# EAGLE design adsr (EAGLE 6.5.0)
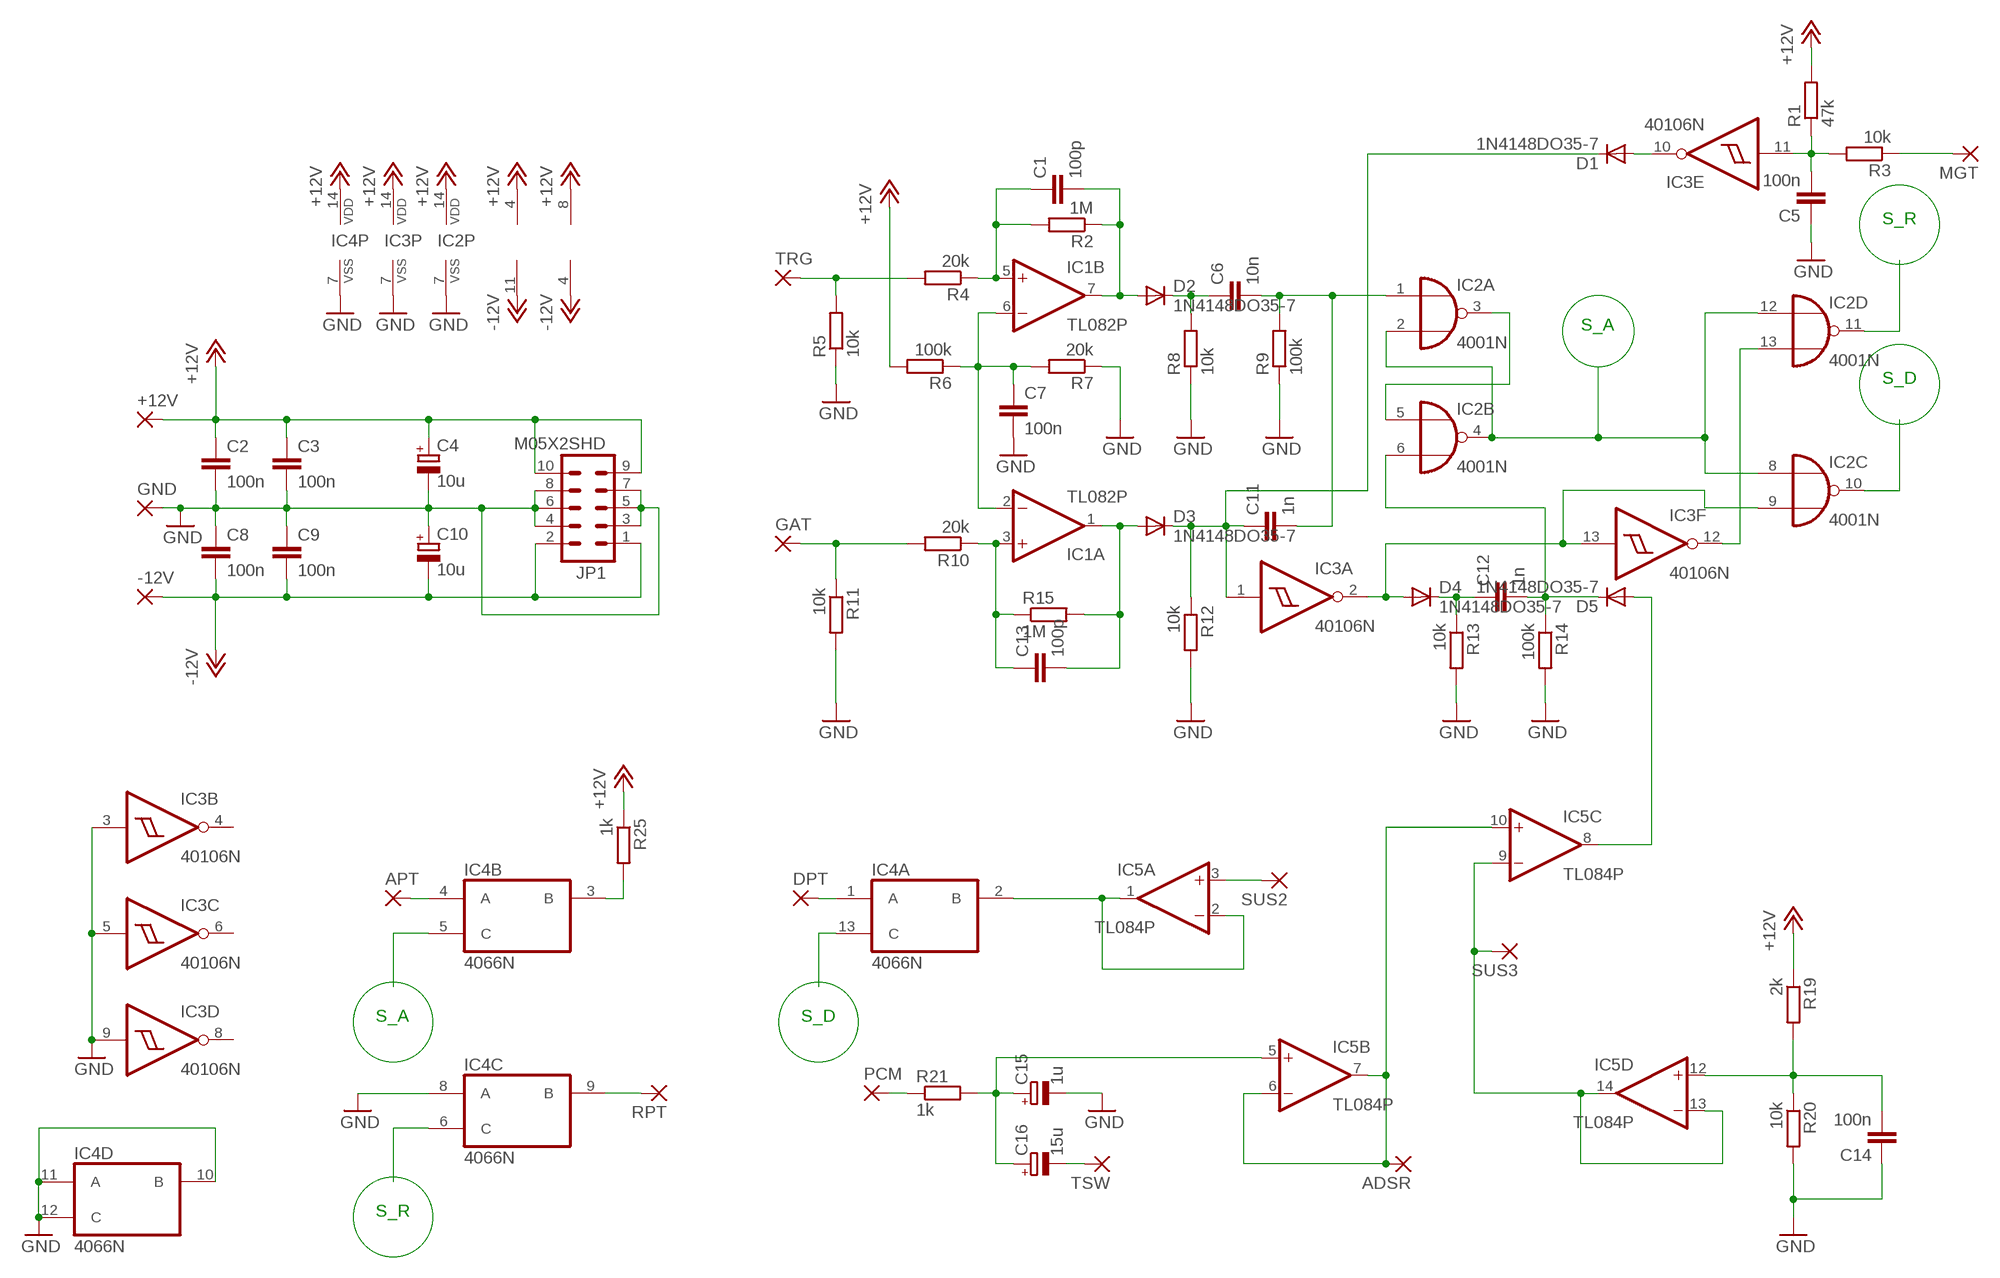
[diagram p0: schematic, sheet 1]

## Parts
+12V  2,54/1,0  [2,54/1,0]
-12V  2,54/1,0  [2,54/1,0]
ADSR  2,54/1,0  [2,54/1,0]
APT  2,54/1,0  [2,54/1,0]
C1  100p  C-EU050-035X075  [C050-035X075]
C2  100n  C-EU050-035X075  [C050-035X075]
C3  100n  C-EU050-035X075  [C050-035X075]
C4  10u  CPOL-EUE3.5-8  [E3,5-8]
C5  100n  C-EU050-035X075  [C050-035X075]
C6  10n  C-EU050-035X075  [C050-035X075]
C7  100n  C-EU050-035X075  [C050-035X075]
C8  100n  C-EU050-035X075  [C050-035X075]
C9  100n  C-EU050-035X075  [C050-035X075]
C10  10u  CPOL-EUE3.5-8  [E3,5-8]
C11  1n  C-EU050-035X075  [C050-035X075]
C12  1n  C-EU050-035X075  [C050-035X075]
C13  100p  C-EU050-035X075  [C050-035X075]
C14  100n  C-EU050-035X075  [C050-035X075]
C15  1u  CPOL-EUE2.5-6  [E2,5-6]
C16  15u  CPOL-EUE3.5-8  [E3,5-8]
D1  1N4148DO35-7  [DO35-7]
D2  1N4148DO35-7  [DO35-7]
D3  1N4148DO35-7  [DO35-7]
D4  1N4148DO35-7  [DO35-7]
D5  1N4148DO35-7  [DO35-7]
DPT  2,54/1,0  [2,54/1,0]
GAT  2,54/1,0  [2,54/1,0]
GND  2,54/1,0  [2,54/1,0]
IC1  TL082P  [DIL08]
IC2  4001N  [DIL14]
IC3  40106N  [DIL14]
IC4  4066N  [DIL14]
IC5  TL084P  [DIL14]
JP1  M05X2SHD  [2X5-SHROUDED]
MGT  2,54/1,0  [2,54/1,0]
PCM  2,54/1,0  [2,54/1,0]
R1  47k  R-EU_0309/10  [0309/10]
R2  1M  R-EU_0309/10  [0309/10]
R3  10k  R-EU_0309/10  [0309/10]
R4  20k  R-EU_0309/10  [0309/10]
R5  10k  R-EU_0309/10  [0309/10]
R6  100k  R-EU_0309/10  [0309/10]
R7  20k  R-EU_0309/10  [0309/10]
R8  10k  R-EU_0309/10  [0309/10]
R9  100k  R-EU_0309/10  [0309/10]
R10  20k  R-EU_0309/10  [0309/10]
R11  10k  R-EU_0309/10  [0309/10]
R12  10k  R-EU_0309/10  [0309/10]
R13  10k  R-EU_0309/10  [0309/10]
R14  100k  R-EU_0309/10  [0309/10]
R15  1M  R-EU_0309/10  [0309/10]
R19  2k  R-EU_0309/10  [0309/10]
R20  10k  R-EU_0309/10  [0309/10]
R21  1k  R-EU_0309/10  [0309/10]
R25  1k  R-EU_0309/10  [0309/10]
RPT  2,54/1,0  [2,54/1,0]
SUS2  2,54/1,0  [2,54/1,0]
SUS3  2,54/1,0  [2,54/1,0]
TRG  2,54/1,0  [2,54/1,0]
TSW  2,54/1,0  [2,54/1,0]

## Nets
+12V: +12V.1(P) C2.1 C3.1 C4.+ IC1.8(P:V+) IC2.14(P:VDD) IC3.14(P:VDD) IC4.14(P:VDD) IC5.4(P:V+) JP1.9 JP1.10 R1.2 R6.2 R19.1 R25.1
-12V: -12V.1(P) C8.2 C9.2 C10.- IC1.4(P:V-) IC5.11(P:V-) JP1.1 JP1.2
GND: C2.2 C3.2 C4.- C5.1 C7.2 C8.1 C9.1 C10.+ C14.1 C15.- GND.1(P) IC2.7(P:VSS) IC3.3(B:I) IC3.5(C:I) IC3.7(P:VSS) IC3.9(D:I) IC4.7(P:VSS) IC4.8(C:A) IC4.10(D:B) IC4.11(D:A) IC4.12(D:C) JP1.3 JP1.4 JP1.5 JP1.6 JP1.7 JP1.8 R5.1 R7.1 R8.1 R9.1 R11.2 R12.2 R13.2 R14.2 R20.2
N$1: C1.1 IC1.5(B:+IN) R2.2 R4.1
N$2: R4.2 R5.2 TRG.1(P)
N$3: C1.2 D2.A IC1.7(B:OUT) R2.1
N$4: C7.1 IC1.2(A:-IN) IC1.6(B:-IN) R6.1 R7.2
N$5: C6.1 D2.C R8.2
N$6: C6.2 C11.2 IC2.1(A:I0) R9.2
N$7: C13.2 D3.A IC1.1(A:OUT) R15.2
N$8: C13.1 IC1.3(A:+IN) R10.1 R15.1
N$9: GAT.1(P) R10.2 R11.1
N$10: D4.A IC2.9(C:I1) IC3.2(A:O) IC3.13(F:I)
N$11: IC2.3(A:O) IC2.5(B:I0)
N$12: C11.1 D1.C D3.C IC3.1(A:I) R12.1
N$13: C12.1 D4.C R13.1
N$14: C12.2 D5.C IC2.6(B:I1) R14.1
N$15: D5.A IC5.8(C:OUT)
N$16: IC2.13(D:I1) IC3.12(F:O)
N$17: C5.2 IC3.11(E:I) R1.1 R3.2
N$18: D1.A IC3.10(E:O)
N$19: MGT.1(P) R3.1
N$20: IC5.9(C:-IN) IC5.13(D:-IN) IC5.14(D:OUT) SUS3.1(P)
N$21: ADSR.1(P) IC5.6(B:-IN) IC5.7(B:OUT) IC5.10(C:+IN)
N$22: IC5.3(A:+IN) SUS2.1(P)
N$23: IC4.2(A:B) IC5.1(A:OUT) IC5.2(A:-IN)
N$24: DPT.1(P) IC4.1(A:A)
N$25: APT.1(P) IC4.4(B:A)
N$26: IC4.3(B:B) R25.2
N$27: IC4.9(C:B) RPT.1(P)
N$28: PCM.1(P) R21.1
N$29: C16.- TSW.1(P)
N$30: C15.+ C16.+ IC5.5(B:+IN) R21.2
N$31: C14.2 IC5.12(D:+IN) R19.2 R20.1
S_A: IC2.2(A:I1) IC2.4(B:O) IC2.8(C:I0) IC2.12(D:I0) IC4.5(B:C)
S_D: IC2.10(C:O) IC4.13(A:C)
S_R: IC2.11(D:O) IC4.6(C:C)
Unconnected: IC3.4(B:O) IC3.6(C:O) IC3.8(D:O)

## Notes on the sheet
- S_R
- S_A
- S_D
- S_A | S_D
- S_R

## Library data of the parts
+12V -12V ADSR APT DPT GAT GND MGT PCM RPT SUS2 SUS3 TRG TSW = wirepad:2,54/1,0: THROUGH-HOLE PAD
C1-C3 C5-C9 C11-C14 = rcl:C-EU: CAPACITOR, European symbol
C4 C10 C15 C16 = rcl:CPOL-EU: POLARIZED CAPACITOR, European symbol
D1-D5 = diode:1N4148: DIODE high speed (Philips)
IC1 = cavalier:TL082: OP AMP
IC2 = 40xx:4001: Quad 2-input NOR
IC3 = 40xx:40106: Hex SCHMITT TRIGGER
IC4 = 40xx:4066: Quad bilateral ANALOG SWITCH
IC5 = cavalier:TL084: OP AMP
JP1 = SparkFun:M05X2: Header 5x2 Standard 10-pin dual row 0.1" header. Commonly used with AVR-ISP. Use with Spark Fun Electronics SKU: PRT-00778
R1-R15 R19-R21 R25 = rcl:R-EU_: RESISTOR, European symbol

## Board
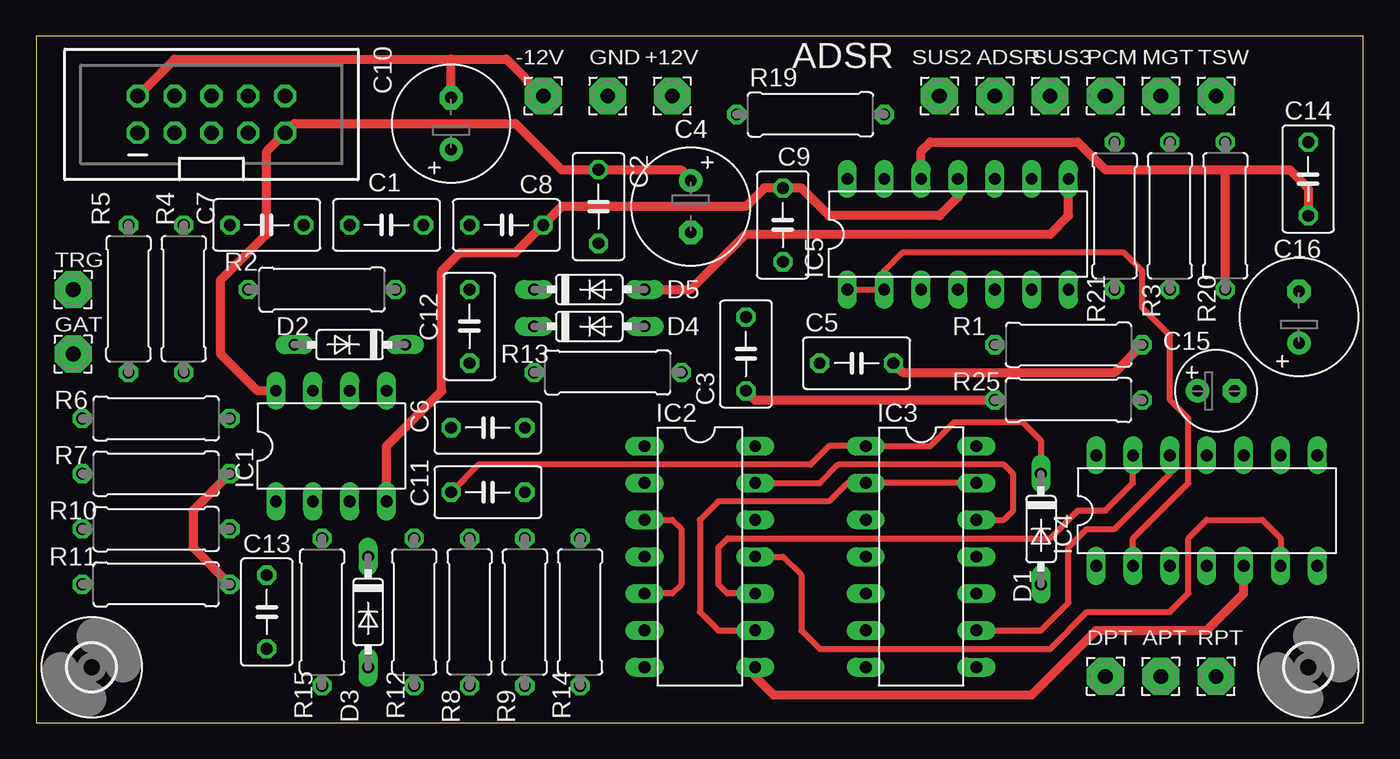
[diagram p1: board, top side]
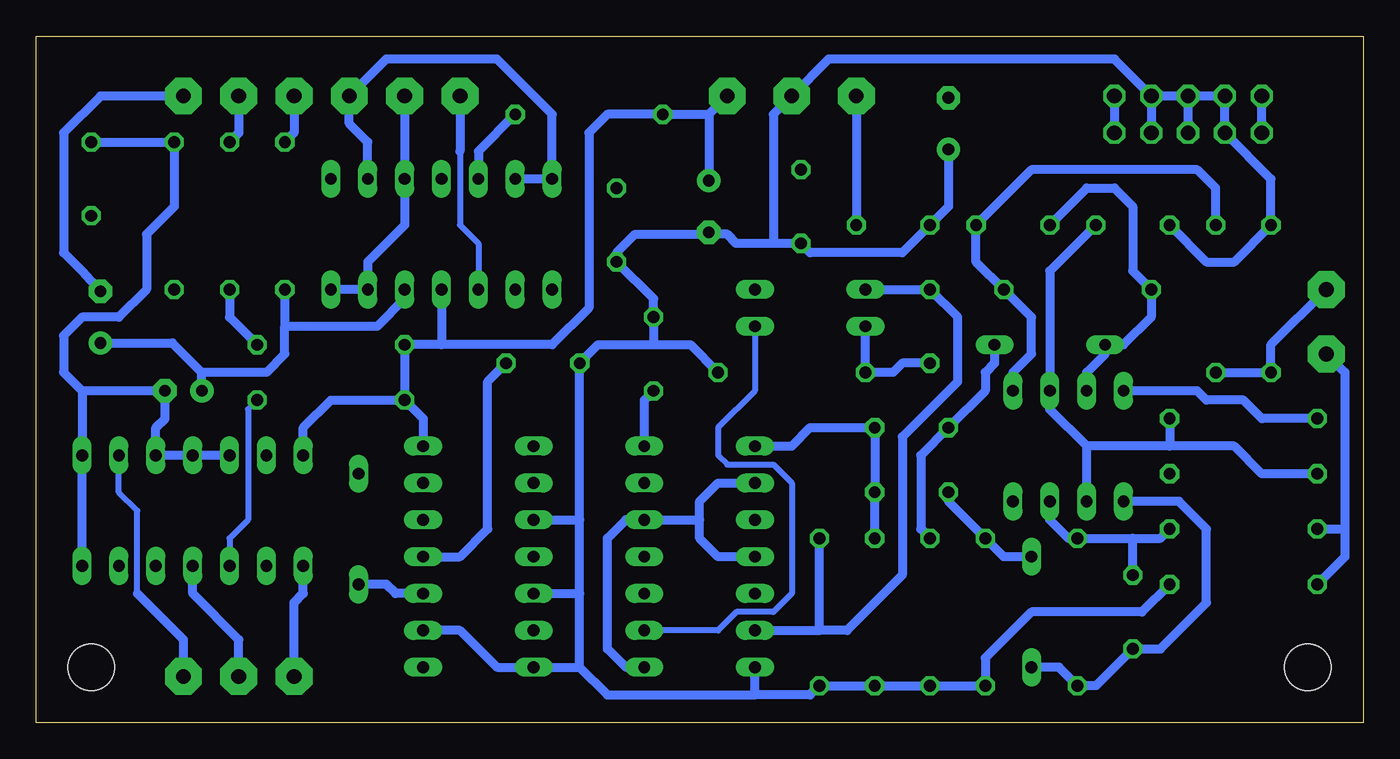
[diagram p2: board, bottom side, seen from below]

Size 91.42 x 47.3 mm. Coordinates in mm from the lower left corner, seen from the top.
Outline: 0,0 91.42,0 91.42,47.3 0,47.3 0,0
Copper layers (1*16): Top 0.035mm / dielectric 1.5mm / Bottom 0.035mm
Design rules "default": minimum track width 10mil, minimum drill 24mil, track to track 8mil, track to pad 8mil, pad to pad 8mil, via to via 8mil, smd to smd 8mil, copper to edge 40mil, drill to drill 8mil, minimum pad ring 10mil, minimum via ring 8mil, stop-mask expansion 4mil, vias tented up to drill 0mil, thermal gap 10mil

### Footprints (pad centres in the part's own frame; a part is rotated, then mirrored left to right if it is on the bottom)
2,54/1,0 = drill 1.016 pad 2.54 octagon: 1 0,0
C050-035X075 = drill 0.813 octagon: 1 -2.54,0; 2 2.54,0
E3,5-8 = drill 0.813 pad 1.6: + -1.778,0 | drill 0.813 pad 1.6 octagon: - 1.778,0
E2,5-6 = drill 0.813 pad 1.6: + -1.27,0 | drill 0.813 pad 1.6 octagon: - 1.27,0
DO35-7 = drill 0.813 long: A 3.81,0; C -3.81,0
DIL08 = drill 0.813 pad 1.27 long: 1 -3.81,-3.81; 2 -1.27,-3.81; 3 1.27,-3.81; 4 3.81,-3.81; 5 3.81,3.81; 6 1.27,3.81; 7 -1.27,3.81; 8 -3.81,3.81
DIL14 = drill 0.813 long: 1 -7.62,-3.81; 2 -5.08,-3.81; 3 -2.54,-3.81; 4 0,-3.81; 5 2.54,-3.81; 6 5.08,-3.81; 7 7.62,-3.81; 8 7.62,3.81; 9 5.08,3.81; 10 2.54,3.81; 11 0,3.81; 12 -2.54,3.81; 13 -5.08,3.81; 14 -7.62,3.81
2X5-SHROUDED = drill 1.016 octagon: 1 -1.27,5.08; 2 1.27,5.08; 3 -1.27,2.54; 4 1.27,2.54; 5 -1.27,0; 6 1.27,0; 7 -1.27,-2.54; 8 1.27,-2.54; 9 -1.27,-5.08; 10 1.27,-5.08
0309/10 = drill 0.813 octagon: 1 -5.08,0; 2 5.08,0
3,2 = hole 3.2: 0,0

### Placement (x,y rotation side)
+12V  43.81,43.18 0 top
-12V  34.92,43.18 0 top
ADSR  66.04,43.18 0 top
APT  77.47,3.17 0 top
C1  24.13,34.29 180 top
C2  38.73,35.56 270 top
C3  48.9,25.4 90 top
C4  45.09,35.56 270 top
C5  56.52,24.77 0 top
C6  31.11,20.32 0 top
C7  15.88,34.29 180 top
C8  32.38,34.29 0 top
C9  51.44,34.29 90 top
C10  28.57,41.27 90 top
C11  31.11,15.88 0 top
C12  29.84,27.3 90 top
C13  15.88,7.62 270 top
C14  87.63,37.47 270 top
C15  81.28,22.86 0 top
C16  87,27.94 90 top
D1  69.22,13.34 270 top
D2  21.59,26.04 180 top
D3  22.86,7.62 270 top
D4  38.1,27.3 0 top
D5  38.1,29.84 0 top
DPT  73.66,3.17 0 top
GAT  2.54,25.4 0 top
GND  39.37,43.18 0 top
IC1  20.32,19.05 0 top
IC2  45.72,11.43 270 top
IC3  60.96,11.43 270 top
IC4  80.64,14.61 0 top
IC5  63.5,33.66 0 top
JP1  12.06,41.91 90 top
MGT  77.47,43.18 0 top
PCM  73.66,43.18 0 top
R1  71.12,26.04 180 top
R2  19.68,29.84 0 top
R3  78.11,34.92 270 top
R4  10.16,29.21 270 top
R5  6.35,29.21 270 top
R6  8.26,20.95 180 top
R7  8.26,17.14 180 top
R8  29.84,7.62 90 top
R9  33.66,7.62 90 top
R10  8.26,13.34 180 top
R11  8.26,9.53 0 top
R12  26.04,7.62 270 top
R13  39.37,24.13 0 top
R14  37.47,7.62 270 top
R15  19.68,7.62 270 top
R19  53.34,41.91 0 top
R20  81.92,34.92 90 top
R21  74.3,34.92 270 top
R25  71.12,22.23 0 top
RPT  81.28,3.17 0 top
SUS2  62.23,43.18 0 top
SUS3  69.85,43.18 0 top
TRG  2.54,29.84 0 top
TSW  81.28,43.18 0 top
U$1  [3,2]  3.81,3.81 0 top
U$2  [3,2]  87.63,3.81 0 top

### Tracks (layer width: path | path; a pad name or v marks a point on that pad's centre or on a via)
+12V
  Top 0.61: C4.+ 44.96,37.47 44.45,38.1 C2.1 36.2,38.1 33.02,41.27 17.78,41.27 JP1.9 15.88,39.37 15.88,33.66 12.7,30.48 12.7,25.4 15.24,22.86 IC1.8 | C3.1 49.53,22.23 R25.1
  Bottom 0.61: JP1.10 JP1.9 | R6.2 6.99,20.95 8.26,22.23 10.79,22.23 11.43,22.86 IC1.8 | IC4.14 73.03,20.32 71.12,22.23 R25.1 | IC5.4 63.5,26.04 | R25.1 R1.2 63.5,26.04 | R25.1 64.77,20.95 IC3.14 | IC2.14 49.53,22.23 C3.1 | +12V.1 45.09,41.91 | 45.09,41.91 C4.+ | 63.5,26.04 55.88,26.04 53.34,28.57 53.34,40.64 52.07,41.91 R19.1 45.09,41.91
-12V
  Top 0.61: IC5.11 63.5,36.2 62.23,34.92 54.61,34.92 52.7,36.83 C9.2 50.16,36.83 48.9,35.56 36.2,35.56 C8.2 33.02,32.38 29.21,32.38 27.94,31.11 27.94,22.86 24.13,19.05 IC1.4 | JP1.2 9.53,45.72 28.57,45.72 | 28.57,45.72 32.38,45.72 -12V.1 | C10.- 28.57,45.72
  Bottom 0.61: JP1.1 JP1.2 | -12V.1 C8.2
GND
  Top 0.406: IC3.9 69.22,6.35 71.12,8.26 71.12,12.06 72.39,13.34 74.3,13.34 78.11,17.14 IC4.12
  Top 0.61: R7.1 10.79,14.61 10.79,12.06 R11.2
  Bottom 0.61: JP1.8 JP1.7 | JP1.6 JP1.4 JP1.3 6.35,37.47 R5.1 8.89,31.75 10.79,31.75 C7.2 | JP1.6 JP1.8 | C14.1 R20.2 81.92,35.56 83.82,33.66 83.82,29.84 85.72,27.94 88.27,27.94 89.53,26.67 89.53,24.13 88.27,22.86 | 88.27,22.86 IC4.8 | 88.27,17.78 IC4.8 | IC4.12 IC4.11 IC4.10 83.19,20.32 82.55,20.95 C15.- 88.27,22.86 | IC4.7 IC4.8 | IC3.9 62.23,6.35 59.69,3.81 IC3.7 53.98,3.81 | 53.98,3.81 52.07,1.91 41.91,1.91 | 41.91,1.91 IC2.7 | 53.98,3.81 53.98,8.89 | 53.98,8.89 53.98,13.97 | 48.9,26.04 52.7,26.04 C5.1 53.98,13.97 | 48.9,26.04 46.35,26.04 R13.2 | 48.9,26.04 C3.2 48.9,29.21 C9.1 51.44,32.38 50.16,33.66 45.21,33.66 C4.- 44.96,33.66 43.81,33.66 43.18,33.02 40.64,33.02 | 40.64,33.02 C2.2 38.1,32.38 31.75,32.38 C8.1 28.57,35.56 C10.+ | 40.64,33.02 40.64,41.91 GND.1 36.83,45.72 17.14,45.72 JP1.8 | IC3.3 53.98,13.97 | IC3.5 53.98,8.89 | R11.2 15.24,7.62 22.86,7.62 26.04,4.45 R12.2 R8.1 R9.1 R14.2 38.1,1.91 41.91,1.91 | JP1.5 JP1.6
N$1
  Bottom 0.61: IC1.5 24.13,24.13 22.86,25.4 22.86,27.94 R2.2 26.67,31.75 C1.1 22.86,38.1 11.43,38.1 10.16,36.83 R4.1
N$2
  Bottom 0.61: R4.2 R5.2 6.35,26.04 TRG.1
N$3
  Bottom 0.61: C1.2 19.05,36.83 17.14,36.83 15.88,35.56 15.88,31.11 R2.1 14.61,27.94 16.51,26.04 D2.A 17.78,25.4 19.05,24.13 IC1.7
N$4
  Bottom 0.61: R6.1 13.34,19.05 | 13.34,19.05 19.05,19.05 | 19.05,19.05 21.59,21.59 IC1.6 21.59,31.11 C7.1 | IC1.2 19.05,19.05 | R7.2 6.99,17.14 8.89,19.05 13.34,19.05
N$5
  Bottom 0.61: R8.2 30.48,13.34 30.48,18.41 C6.1 26.04,22.86 26.04,24.13 25.4,24.77 D2.C
N$6
  Bottom 0.61: IC2.1 39.37,19.05 38.1,20.32 C6.2 C11.2 R9.2
N$7
  Bottom 0.61: IC1.1 12.7,15.24 10.79,13.34 10.79,8.26 13.97,5.08 C13.2 18.41,2.54 R15.2 20.95,3.81 D3.A
N$8
  Bottom 0.61: IC1.3 21.59,13.97 20.32,12.7 R15.1 15.88,12.7 | 15.88,12.7 13.97,12.7 R10.1 | C13.1 15.88,12.7
N$9
  Bottom 0.61: GAT.1 1.27,24.13 1.27,13.34 | 1.27,13.34 1.27,11.43 R11.1 | R10.2 1.27,13.34
N$10
  Top 0.406: IC3.13 IC3.2 55.88,16.51 54.61,15.24 46.99,15.24 45.72,13.97 45.72,7.62 46.99,6.35 IC2.9
  Bottom 0.406: D4.A 41.91,22.86 44.45,20.32 44.45,18.41 43.81,17.78 40.64,17.78 39.37,16.51 39.37,8.89 40.64,7.62 43.18,7.62 44.45,6.35 IC2.9
N$11
  Top 0.406: IC2.3 43.81,13.97 44.45,13.34 44.45,9.53 43.81,8.89 IC2.5
N$12
  Top 0.406: C11.1 30.48,17.78 53.34,17.78 54.61,19.05 IC3.1 61.59,19.05 63.25,20.7 67.94,20.7 69.22,19.43 D1.C
  Bottom 0.61: D3.C 24.77,11.43 R12.1 28.57,15.24 C11.1
N$13
  Bottom 0.61: C12.1 31.75,24.77 32.38,24.13 R13.1 D4.C
N$14
  Bottom 0.61: IC2.6 37.47,6.35 | 37.47,6.35 R14.1 | D5.C C12.2 27.94,27.94 27.94,23.5 31.75,19.68 31.75,10.16 35.56,6.35 37.47,6.35
N$15
  Top 0.61: D5.A 45.09,29.84 48.9,33.66 69.85,33.66 71.12,34.92 IC5.8
N$16
  Top 0.406: IC2.13 53.98,16.51 55.24,17.78 66.67,17.78 67.31,17.14 67.31,14.61 66.67,13.97 IC3.12
N$17
  Top 0.61: C5.2 59.69,24.13 74.3,24.13 R1.1
  Bottom 0.61: R3.2 78.11,27.94 R1.1 | IC3.11 62.23,11.43 60.33,13.34 60.33,23.5 C5.2
N$18
  Bottom 0.61: IC3.10 66.67,8.89 67.31,9.53 D1.A
N$19
  Bottom 0.61: MGT.1 77.47,40.64 R3.1
N$20
  Bottom 0.61: IC5.9 68.58,40.01 69.85,41.27 SUS3.1 67.31,45.72 59.69,45.72 55.88,41.91 IC5.14 IC5.13
N$21
  Bottom 0.61: ADSR.1 IC5.10 66.04,34.29 68.58,31.75 IC5.6 IC5.7
N$22
  Bottom 0.406: 62.23,39.37 62.23,34.29 60.96,33.02 IC5.3
  Bottom 0.61: SUS2.1 62.23,39.37
N$23
  Top 0.406: IC4.2 75.56,12.7 79.38,16.51 79.38,20.95 78.11,22.23 78.11,26.67 76.2,28.57 76.2,31.11 74.93,32.38 59.69,32.38 58.42,31.11 IC5.2 IC5.1
N$24
  Bottom 0.61: DPT.1 73.66,8.26 73.03,8.89 IC4.1
N$25
  Bottom 0.61: APT.1 77.47,5.71 80.64,8.89 IC4.4
N$26
  Bottom 0.406: R25.2 76.83,21.59 76.83,13.97 78.11,12.7 IC4.3
N$27
  Bottom 0.406: 84.45,8.89 84.45,14.61 85.72,15.88 IC4.9
  Bottom 0.61: RPT.1 81.28,5.71 84.45,8.89
N$28
  Bottom 0.61: PCM.1 73.66,40.64 R21.1
N$29
  Bottom 0.61: TSW.1 87,43.18 89.53,40.64 89.53,32.38 88.27,31.11 87.12,29.84 C16.-
N$30
  Bottom 0.61: IC5.5 66.04,29.21 67.94,27.3 74.3,27.3 | 80.01,24.13 75.56,24.13 74.3,25.4 74.3,27.3 | R21.2 74.3,27.3 | C16.+ 82.04,26.16 80.01,24.13 | C15.+ 80.01,24.13
N$31
  Top 0.61: IC5.12 60.96,39.37 61.59,40.01 71.75,40.01 73.66,38.1 81.92,38.1 | 81.92,38.1 86.36,38.1 87.63,36.83 C14.2 | R20.1 81.92,38.1
  Bottom 0.61: R19.2 60.96,39.37 IC5.12
S_A
  Top 0.61: IC2.8 49.53,3.17 50.8,1.91 68.58,1.91 73.03,6.35 80.64,6.35 83.19,8.89 IC4.5
  Bottom 0.61: IC2.8 50.8,3.81 52.07,5.08 52.07,12.7 50.8,13.97 IC2.12 45.72,13.97 | IC2.4 44.45,11.43 45.72,12.7 45.72,13.97 | 45.72,13.97 45.72,15.24 44.45,16.51 IC2.2
S_D
  Top 0.406: IC2.10 47.62,8.89 46.99,9.53 46.99,12.06 47.62,12.7 69.85,12.7 71.75,14.61 73.66,14.61 75.56,16.51 IC4.13
S_R
  Top 0.406: IC2.11 51.44,11.43 52.7,10.16 52.7,6.35 53.98,5.08 69.85,5.08 72.39,7.62 78.11,7.62 79.38,8.89 79.38,12.7 80.64,13.97 84.45,13.97 85.72,12.7 IC4.6

### Text on the board
tPlace: ADSR